# Altium schematic sheet 04)SDRAM.SchDoc
size 297 x 209 mm
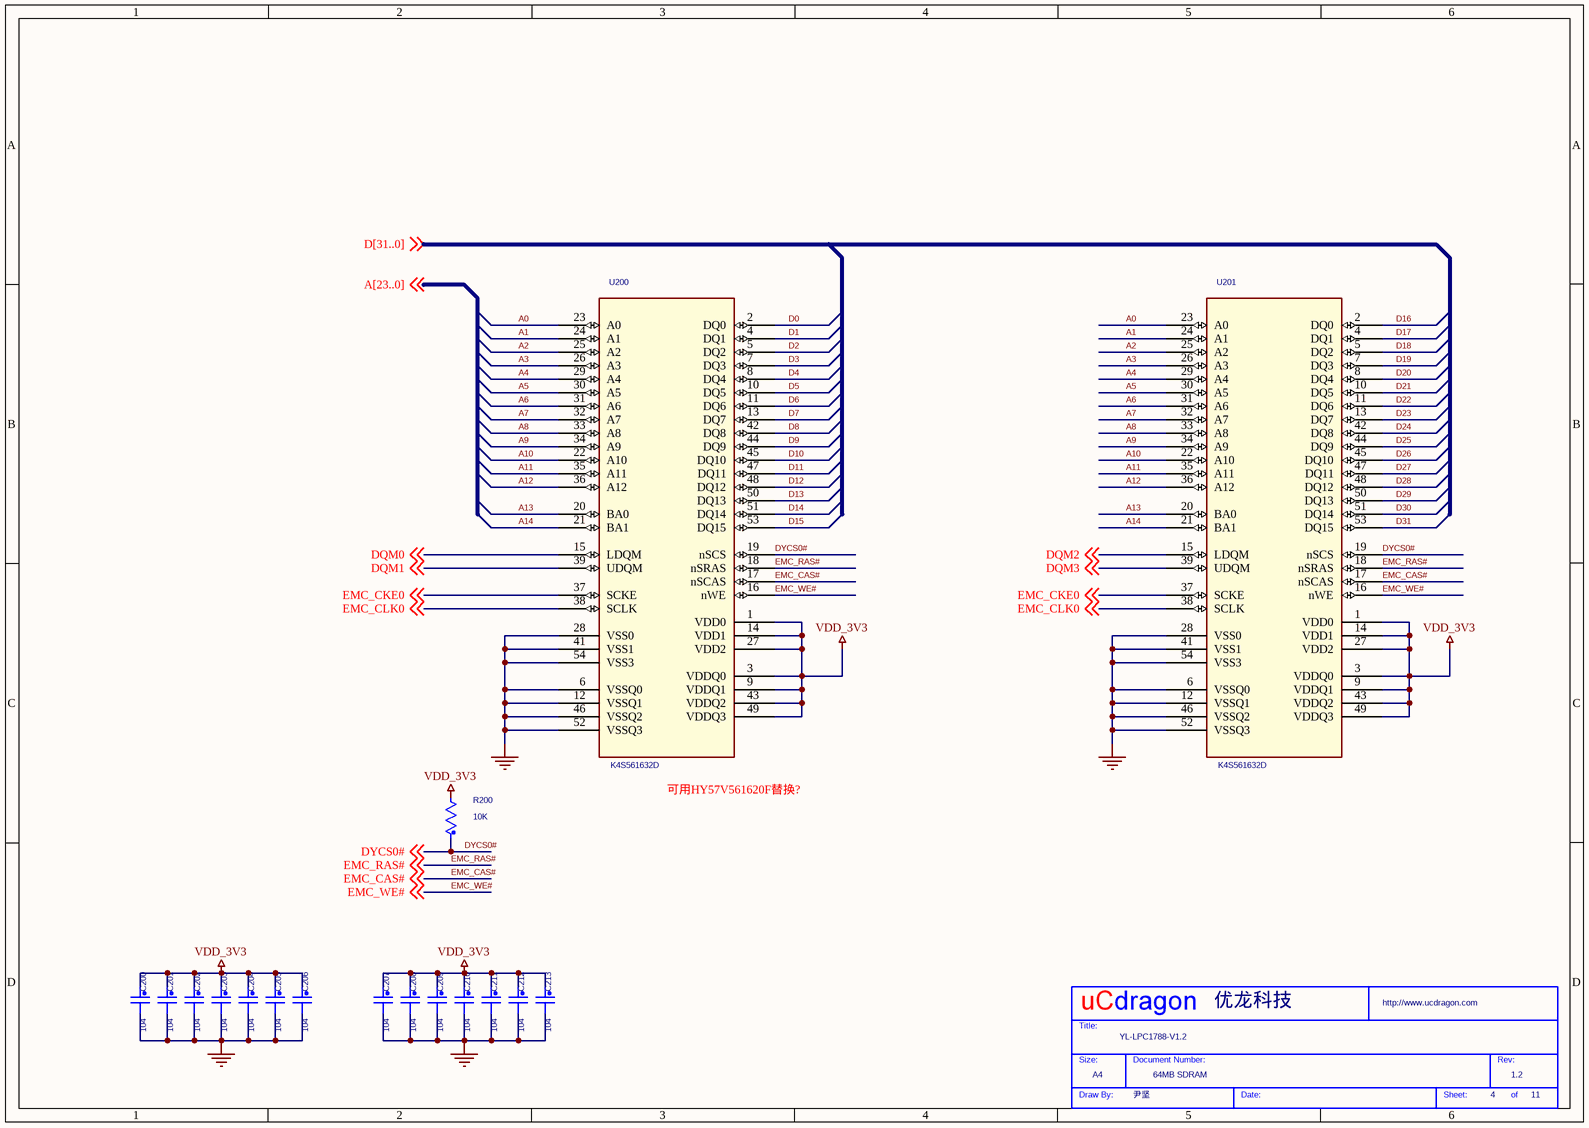
[diagram p0: 04)SDRAM.SchDoc]

## Parts
*  Page Count: 11  Page Number: 4  Page Size: A4  Title: YL-LPC1788-V1.2  RevCode: 1.2  Doc: 64MB SDRAM  Drawing: 尹坚  Company: 优龙科技  (hidden comment: My Title 0)  (graphical)
C200  104  [0603P]
C201  104  [0603P]
C202  104  [0603P]
C203  104  [0603P]
C204  104  [0603P]
C205  104  [0603P]
C206  104  [0603P]
C207  104  [0603P]
C208  104  [0603P]
C209  104  [0603P]
C210  104  [0603P]
C211  104  [0603P]
C212  104  [0603P]
C213  104  [0603P]
R200  10K  [0603P]
U200  K4S561632D  [54_TSOP2_400AF_L]
U201  K4S561632D  [54_TSOP2_400AF_L]

## Nets
GND_POWER: C200.2 C201.2 C202.2 C203.2 C204.2 C205.2 C206.2 C207.2 C208.2 C209.2 C210.2 C211.2 C212.2 C213.2 U200.6(VSSQ0) U200.12(VSSQ1) U200.28(VSS0) U200.41(VSS1) U200.46(VSSQ2) U200.52(VSSQ3) U200.54(VSS3) U201.6(VSSQ0) U201.12(VSSQ1) U201.28(VSS0) U201.41(VSS1) U201.46(VSSQ2) U201.52(VSSQ3) U201.54(VSS3)
VDD_3V3: C200.1 C201.1 C202.1 C203.1 C204.1 C205.1 C206.1 C207.1 C208.1 C209.1 C210.1 C211.1 C212.1 C213.1 R200.2 U200.1(VDD0) U200.3(VDDQ0) U200.9(VDDQ1) U200.14(VDD1) U200.27(VDD2) U200.43(VDDQ2) U200.49(VDDQ3) U201.1(VDD0) U201.3(VDDQ0) U201.9(VDDQ1) U201.14(VDD1) U201.27(VDD2) U201.43(VDDQ2) U201.49(VDDQ3)
A0: U200.23(A0) U201.23(A0)
A1: U200.24(A1) U201.24(A1)
A2: U200.25(A2) U201.25(A2)
A3: U200.26(A3) U201.26(A3)
A4: U200.29(A4) U201.29(A4)
A5: U200.30(A5) U201.30(A5)
A6: U200.31(A6) U201.31(A6)
A7: U200.32(A7) U201.32(A7)
A8: U200.33(A8) U201.33(A8)
A9: U200.34(A9) U201.34(A9)
A10: U200.22(A10) U201.22(A10)
A11: U200.35(A11) U201.35(A11)
A12: U200.36(A12) U201.36(A12)
A13: U200.20(BA0) U201.20(BA0)
A14: U200.21(BA1) U201.21(BA1)
D0: U200.2(DQ0)
D1: U200.4(DQ1)
D2: U200.5(DQ2)
D3: U200.7(DQ3)
D4: U200.8(DQ4)
D5: U200.10(DQ5)
D6: U200.11(DQ6)
D7: U200.13(DQ7)
D8: U200.42(DQ8)
D9: U200.44(DQ9)
D10: U200.45(DQ10)
D11: U200.47(DQ11)
D12: U200.48(DQ12)
D13: U200.50(DQ13)
D14: U200.51(DQ14)
D15: U200.53(DQ15)
D16: U201.2(DQ0)
D17: U201.4(DQ1)
D18: U201.5(DQ2)
D19: U201.7(DQ3)
D20: U201.8(DQ4)
D21: U201.10(DQ5)
D22: U201.11(DQ6)
D23: U201.13(DQ7)
D24: U201.42(DQ8)
D25: U201.44(DQ9)
D26: U201.45(DQ10)
D27: U201.47(DQ11)
D28: U201.48(DQ12)
D29: U201.50(DQ13)
D30: U201.51(DQ14)
D31: U201.53(DQ15)
DQM0: U200.15(LDQM) ; off-sheet DQM0
DQM1: U200.39(UDQM) ; off-sheet DQM1
DQM2: U201.15(LDQM) ; off-sheet DQM2
DQM3: U201.39(UDQM) ; off-sheet DQM3
DYCS0#: R200.1 U200.19(nSCS) U201.19(nSCS) ; off-sheet DYCS0#
EMC_CAS#: U200.17(nSCAS) U201.17(nSCAS) ; off-sheet EMC_CAS#
EMC_CKE0: U200.37(SCKE) U201.37(SCKE) ; off-sheet EMC_CKE0
EMC_CLK0: U200.38(SCLK) U201.38(SCLK) ; off-sheet EMC_CLK0
EMC_RAS#: U200.18(nSRAS) U201.18(nSRAS) ; off-sheet EMC_RAS#
EMC_WE#: U200.16(nWE) U201.16(nWE) ; off-sheet EMC_WE#

## Notes on the sheet
- 可用HY57V561620F替换?
- (in symbol My Title 0) Title:; Size:; Document Number:; Rev:; Draw By:; Date:; Sheet:; of

## Library data of the parts
C200-C213 = C_Generic_Dup2
R200 = R_Generic_Dup1
* = My Title 0: Page Create Date: May 29, 2006; WebSite: http://www.ucdragon.com